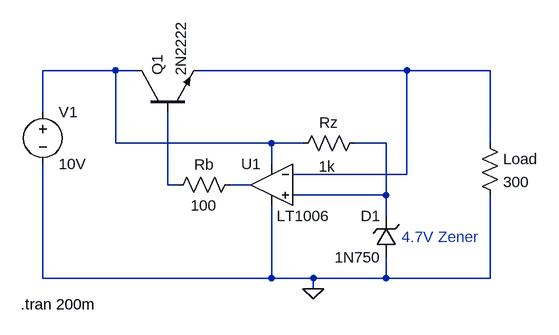
[diagram p0: schematic Linear1.asc]
Linear1.asc, the LTspice schematic file:
Version 4
SHEET 1 880 680
WIRE 64 96 -48 96
WIRE 96 96 64 96
WIRE 512 96 192 96
WIRE 640 96 512 96
WIRE -48 160 -48 96
WIRE 64 208 64 96
WIRE 304 208 64 208
WIRE 352 208 304 208
WIRE 480 208 432 208
WIRE 640 208 640 96
WIRE 304 240 304 208
WIRE 512 256 512 96
WIRE 512 256 336 256
WIRE 144 272 144 160
WIRE 160 272 144 272
WIRE 272 272 240 272
WIRE 480 288 480 208
WIRE 480 288 336 288
WIRE 480 320 480 288
WIRE -48 416 -48 240
WIRE 304 416 304 304
WIRE 304 416 -48 416
WIRE 368 416 304 416
WIRE 480 416 480 384
WIRE 480 416 368 416
WIRE 640 416 640 288
WIRE 640 416 480 416
WIRE 368 432 368 416
FLAG 368 432 0
SYMBOL npn 96 160 R270
SYMATTR InstName Q1
SYMATTR Value 2N2222
SYMBOL voltage -48 144 R0
WINDOW 123 0 0 Left 0
WINDOW 39 0 0 Left 0
SYMATTR InstName V1
SYMATTR Value 10V
SYMBOL zener 496 384 R180
WINDOW 0 24 64 Left 2
WINDOW 3 24 0 Left 2
SYMATTR InstName D1
SYMATTR Value 1N750
SYMBOL Opamps\\LT1006 304 208 M0
WINDOW 3 -90 112 Left 2
SYMATTR InstName U1
SYMBOL res 448 192 R90
WINDOW 0 0 56 VBottom 2
WINDOW 3 36 59 VTop 2
SYMATTR InstName Rz
SYMATTR Value 1k
SYMBOL res 624 192 R0
SYMATTR InstName Load
SYMATTR Value 300
SYMBOL res 256 256 R90
WINDOW 0 0 56 VBottom 2
WINDOW 3 32 56 VTop 2
SYMATTR InstName Rb
SYMATTR Value 100
TEXT 504 352 Left 2 ;4.7V Zener
TEXT -82 456 Left 2 !.tran 200m

The netlist it stands for:
* Linear1.asc
Q1 N001 N004 N002 0 2N2222
V1 N001 0 10V
D1 0 N003 1N750
XU1 N003 N002 N001 0 N005 LT1006  ; pins In+ In- V+ V- OUT
Rz N003 N001 1k
R§Load N002 0 300
Rb N005 N004 100
.model D D
.lib standard.dio
.model NPN NPN
.model PNP PNP
.lib standard.bjt
* 4.7V Zener
.tran 200m
.lib LTC.lib
.backanno
.end